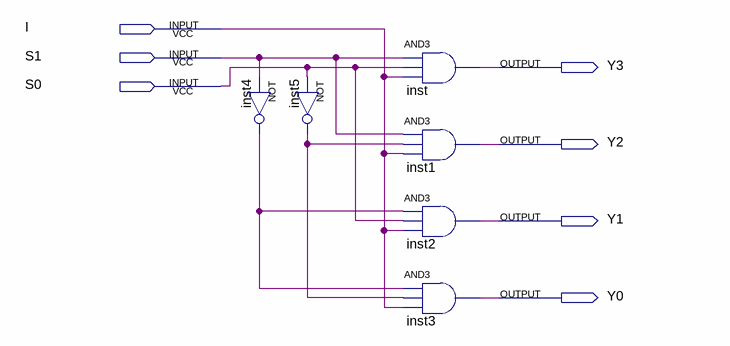
[diagram p0: schematic sheet]
// Quartus schematic lab2_1.bdf as structural Verilog: 6 symbols, 7 pins
module lab2_1 (
  input  I,
  input  S1,
  input  S0,
  output Y3,
  output Y2,
  output Y1,
  output Y0
);

  wire inst4_out, inst5_out;

  not inst4 (inst4_out, S1);
  not inst5 (inst5_out, S0);
  and inst (Y3, S1, S0, I);
  and inst1 (Y2, S1, inst5_out, I);
  and inst2 (Y1, inst4_out, S0, I);
  and inst3 (Y0, inst4_out, inst5_out, I);
endmodule
